# EAGLE design LDAQ-MOD-ENC4 (EAGLE 9.6.2)
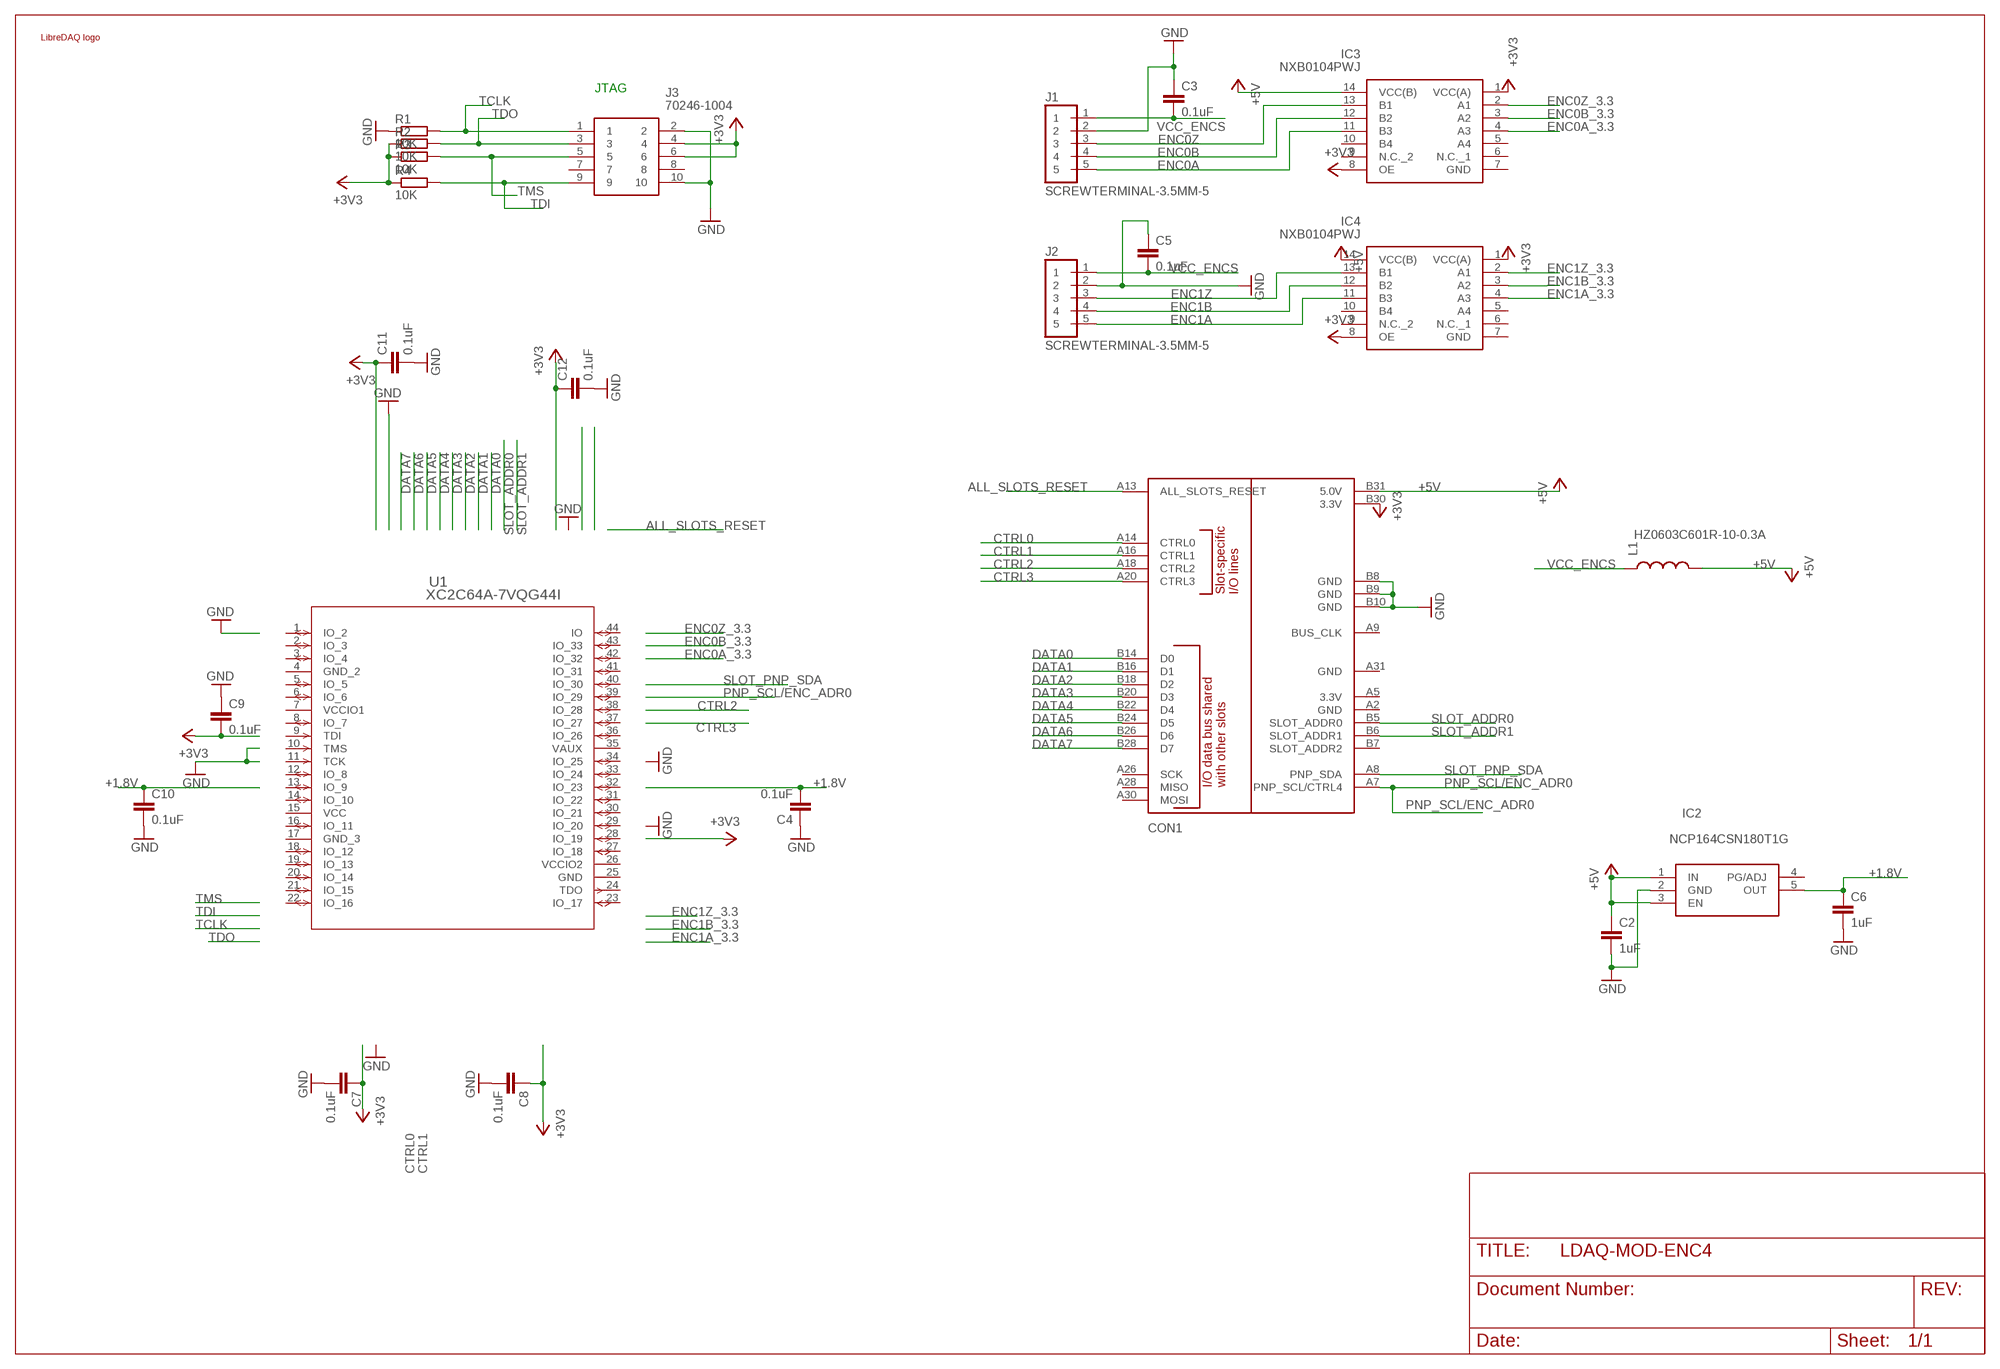
[diagram p0: schematic, sheet 1]

## Parts
C2  1uF  C-EUC0603  [C0603]
C3  0.1uF  0.1UF-25V(+80/-20%)(0603)  [0603-CAP]
C4  0.1uF  0.1UF-25V(+80/-20%)(0603)  [0603-CAP]
C5  0.1uF  0.1UF-25V(+80/-20%)(0603)  [0603-CAP]
C6  1uF  C-EUC0603  [C0603]
C7  0.1uF  0.1UF-25V(+80/-20%)(0603)  [0603-CAP]
C8  0.1uF  0.1UF-25V(+80/-20%)(0603)  [0603-CAP]
C9  0.1uF  0.1UF-25V(+80/-20%)(0603)  [0603-CAP]
C10  0.1uF  0.1UF-25V(+80/-20%)(0603)  [0603-CAP]
C11  0.1uF  0.1UF-25V(+80/-20%)(0603)  [0603-CAP]
C12  0.1uF  0.1UF-25V(+80/-20%)(0603)  [0603-CAP]
CON1  BOARD  LIBREDAQ_DAUGHTER_BOARDPCI-64-SIZE1-PADS  [PCI-E_64_EDGE_70X60_PADS-ONLY]
IC2  NCP164CSN180T1G  [SOT95P275X110-5N]
IC3  NXB0104PWJ  [SOP65P640X110-14N]
IC4  NXB0104PWJ  [SOP65P640X110-14N]
J1  SCREWTERMINAL-3.5MM-5  [SCREWTERMINAL-3.5MM-5]
J2  SCREWTERMINAL-3.5MM-5  [SCREWTERMINAL-3.5MM-5]
J3  70246-1004  [SHDR10W64P254_2X5_2032X889X927]
L1  HZ0603C601R-10-0.3A  INDUCTOR0603  [0603]
LOGO1  LIBREDAQ_LOGO_MINILOGO_GENERIC  [LIBREDAQ_LOGO]
R1  10K  R-EU_R0603  [R0603]
R2  10K  R-EU_R0603  [R0603]
R3  10K  R-EU_R0603  [R0603]
R4  10K  R-EU_R0603  [R0603]
U1  XC2C64A-7VQG44I  [44-VQFP_XIL]

## Nets
+1.8V: C4.2 C6.1 C10.1 IC2.5(OUT)
+3V3: C7.1 C8.1 C9.2 C11.1 C12.1 CON1.B30(3.3V) IC3.1(VCC(A)) IC3.8(OE) IC4.1(VCC(A)) IC4.8(OE) J3.4 J3.6 R2.1 R3.1 R4.1
+5V: C2.1 CON1.B31(5.0V) IC2.1(IN) IC2.3(EN) IC3.14(VCC(B)) IC4.14(VCC(B)) L1.2
ALL_SLOTS_RESET: CON1.A13(ALL_SLOTS_RESET)
CTRL0: CON1.A14(CTRL0)
CTRL1: CON1.A16(CTRL1)
CTRL2: CON1.A18(CTRL2)
CTRL3: CON1.A20(CTRL3)
DATA0: CON1.B14(D0)
DATA1: CON1.B16(D1)
DATA2: CON1.B18(D2)
DATA3: CON1.B20(D3)
DATA4: CON1.B22(D4)
DATA5: CON1.B24(D5)
DATA6: CON1.B26(D6)
DATA7: CON1.B28(D7)
ENC0A: IC3.11(B3) J1.5
ENC0A_3.3: IC3.4(A3)
ENC0B: IC3.12(B2) J1.4
ENC0B_3.3: IC3.3(A2)
ENC0Z: IC3.13(B1) J1.3
ENC0Z_3.3: IC3.2(A1)
ENC1A: IC4.11(B3) J2.5
ENC1A_3.3: IC4.4(A3)
ENC1B: IC4.12(B2) J2.4
ENC1B_3.3: IC4.3(A2)
ENC1Z: IC4.13(B1) J2.3
ENC1Z_3.3: IC4.2(A1)
GND: C2.2 C3.1 C4.1 C5.1 C6.2 C7.2 C8.2 C9.1 C10.2 C11.2 C12.2 CON1.B8(GND) CON1.B9(GND) CON1.B10(GND) IC2.2(GND) J1.2 J2.2 J3.2 J3.10 R1.1
PNP_SCL/ENC_ADR0: CON1.A7(PNP_SCL/CTRL4)
SLOT_ADDR0: CON1.B5(SLOT_ADDR0)
SLOT_ADDR1: CON1.B6(SLOT_ADDR1)
SLOT_PNP_SDA: CON1.A8(PNP_SDA)
TCLK: J3.1 R1.2
TDI: J3.9 R4.2
TDO: J3.3 R2.2
TMS: J3.5 R3.2
VCC_ENCS: C3.2 C5.2 J1.1 J2.1 L1.1
Unconnected: CON1.A2(GND) CON1.A5(3.3V) CON1.A9(BUS_CLK) CON1.A26(SCK) CON1.A28(MISO) CON1.A30(MOSI) CON1.A31(GND) CON1.B7(SLOT_ADDR2) IC2.4(PG/ADJ) IC3.5(A4) IC3.6(N.C._1) IC3.7(GND) IC3.9(N.C._2) IC3.10(B4) IC4.5(A4) IC4.6(N.C._1) IC4.7(GND) IC4.9(N.C._2) IC4.10(B4) J3.7 J3.8 U1.1(IO_2) U1.2(IO_3) U1.3(IO_4) U1.5(IO_5) U1.6(IO_6) U1.8(IO_7) U1.9(TDI) U1.10(TMS) U1.11(TCK) U1.12(IO_8) U1.13(IO_9) U1.14(IO_10) U1.16(IO_11) U1.18(IO_12) U1.19(IO_13) U1.20(IO_14) U1.21(IO_15) U1.22(IO_16) U1.23(IO_17) U1.24(TDO) U1.27(IO_18) U1.28(IO_19) U1.29(IO_20) U1.30(IO_21) U1.31(IO_22) U1.32(IO_23) U1.33(IO_24) U1.34(IO_25) U1.36(IO_26) U1.37(IO_27) U1.38(IO_28) U1.39(IO_29) U1.40(IO_30) U1.41(IO_31) U1.42(IO_32) U1.43(IO_33) U1.44(IO)

## Notes on the sheet
- JTAG

## Power pins joined to a net without a drawn wire
GND: U1.25(GND)
GND_2: U1.4(GND_2)
GND_3: U1.17(GND_3)
VAUX: U1.35(VAUX)
VCC: U1.15(VCC)
VCCIO1: U1.7(VCCIO1)
VCCIO2: U1.26(VCCIO2)

## Library data of the parts
C2 C6 = rcl:C-EU: CAPACITOR, European symbol; SPICEPREFIX: C
C3-C5 C7-C12 = SparkFun-Capacitors:0.1UF-25V(+80/-20%)(0603): CAP-00810 Ceramic Standard decoupling cap; PROD_ID: CAP-00810
CON1 = libredaq-comps:LIBREDAQ_DAUGHTER_BOARD: LibreDAQ Expansion board (PCI-E form)
IC2 = NCP164CSN180T1G:NCP164CSN180T1G: LDO Voltage Regulators LDO 300mA AD 1.8V Source: Datasheet <https://componentsearchengine.com/Datasheets/2/NCP164CSN180T1G.pdf>; DESCRIPTION: LDO Voltage Regulators LDO 300mA AD 1.8V; HEIGHT: 1.1mm; MANUFACTURER_NAME: ON Semiconductor; MANUFACTURER_PART_NUMBER: NCP164CSN180T1G; MOUSER_PART_NUMBER: 863-NCP164CSN180T1G; MOUSER_PRICE-STOCK: https://www.mouser.co.uk/ProductDetail/ON-Semiconductor/NCP164CSN180T1G?qs=xZ%2FP%252Ba9zWqawV010c68oIA%3D%3D
IC3 IC4 = NXB0104PWJ:NXB0104PWJ: Translation - Voltage Levels 3 STATE DUAL SUPPLY TRANS Source: Datasheet <https://componentsearchengine.com/Datasheets/2/NXB0104PWJ.pdf>; DESCRIPTION: Translation - Voltage Levels 3 STATE DUAL SUPPLY TRANS; HEIGHT: 1.1mm; MANUFACTURER_NAME: Nexperia; MANUFACTURER_PART_NUMBER: NXB0104PWJ; MOUSER_PART_NUMBER: 771-NXB0104PWJ; MOUSER_PRICE-STOCK: https://www.mouser.co.uk/ProductDetail/Nexperia/NXB0104PWJ/?qs=Cb2nCFKsA8qTpu5ekoCq9g%3D%3D
J1 J2 = libredaq-comps:SCREWTERMINAL-3.5MM-5
J3 = 70246-1004:70246-1004: Header 2.54mm, dual row, vertical, 10w Molex C-GRID Series, Series Number 70246, 2.54mm Pitch 10 Way 2 Row Shrouded Straight PCB Header, Through Hole Source: Datasheet <http://www.molex.com/pdm_docs/sd/702461004_sd.pdf>; DESCRIPTION: Header 2.54mm, dual row, vertical, 10w Molex C-GRID Series, Series Number 70246, 2.54mm Pitch 10 Way 2 Row Shrouded Straight PCB Header, Through Hole; HEIGHT: 9.27mm; MANUFACTURER_NAME: Molex; MANUFACTURER_PART_NUMBER: 70246-1004; MOUSER_PART_NUMBER: 538-70246-1004; MOUSER_PRICE-STOCK: https://www.mouser.co.uk/ProductDetail/Molex/70246-1004?qs=R7%2FZKp6KZ2by8%252BhtUWbo%252BQ%3D%3D
L1 = SparkFun-Passives:INDUCTOR: Inductors Basic Inductor/Choke - 0603 and 1206. Footprints are not proven and vary greatly between part numbers. SRN6045- 33uH, 20% 1.4A SDR0403-560KL - 56uH, 10%, 500mA RMS/740mA peak
LOGO1 = libredaq-comps:LIBREDAQ_LOGO_MINI
R1-R4 = rcl:R-EU_: RESISTOR, European symbol; SPICEPREFIX: R
U1 = XC2C64A-7VQG44I:XC2C64A-7VQG44I; COPYRIGHT: Copyright (C) 2021 Ultra Librarian. All rights reserved.; DIGI-KEY_PART_NUMBER_1: 122-1708-ND; DIGI-KEY_PART_NUMBER_2: XLCC-1042-ND; DIGI-KEY_PART_NUMBER_3: XLCC-1061-ND; DIGI-KEY_PART_NUMBER_4: XLCC-1062-ND; DIGI-KEY_PART_NUMBER_5: XLCC-1065-ND; DIGI-KEY_PART_NUMBER_6: XLCC-1066-ND; MANUFACTURER_PART_NUMBER: XC2C64A-7VQG44I; MFR_NAME: Xilinx Inc

## Board
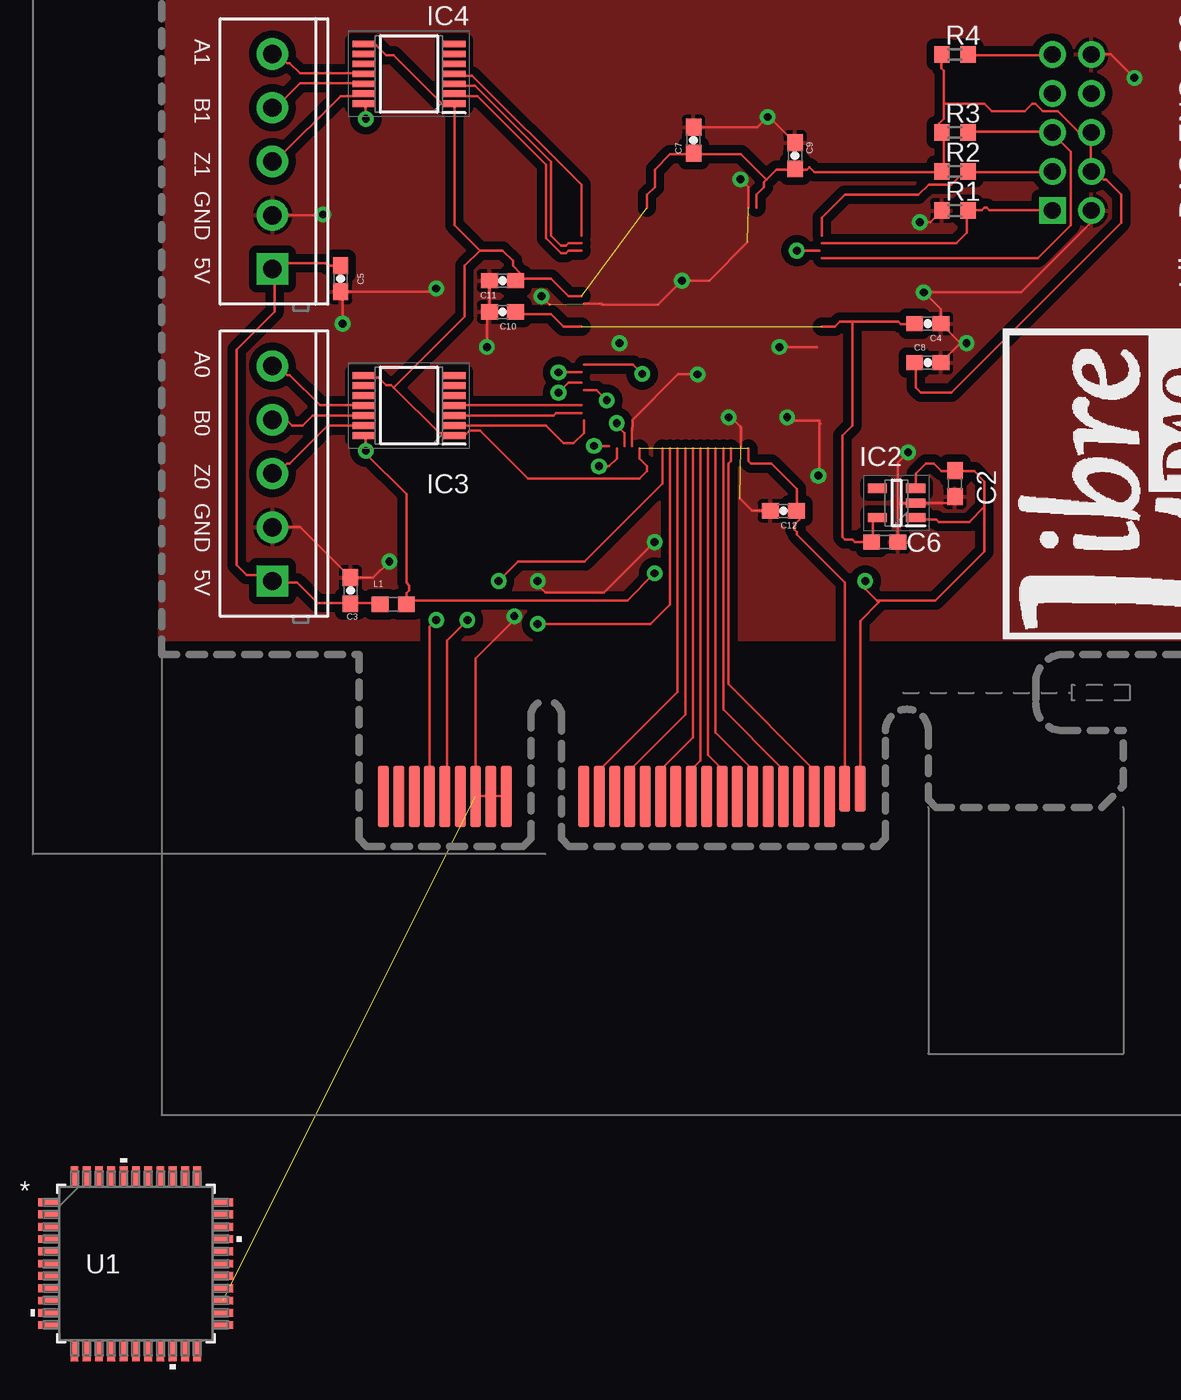
[diagram p1: board, top side]
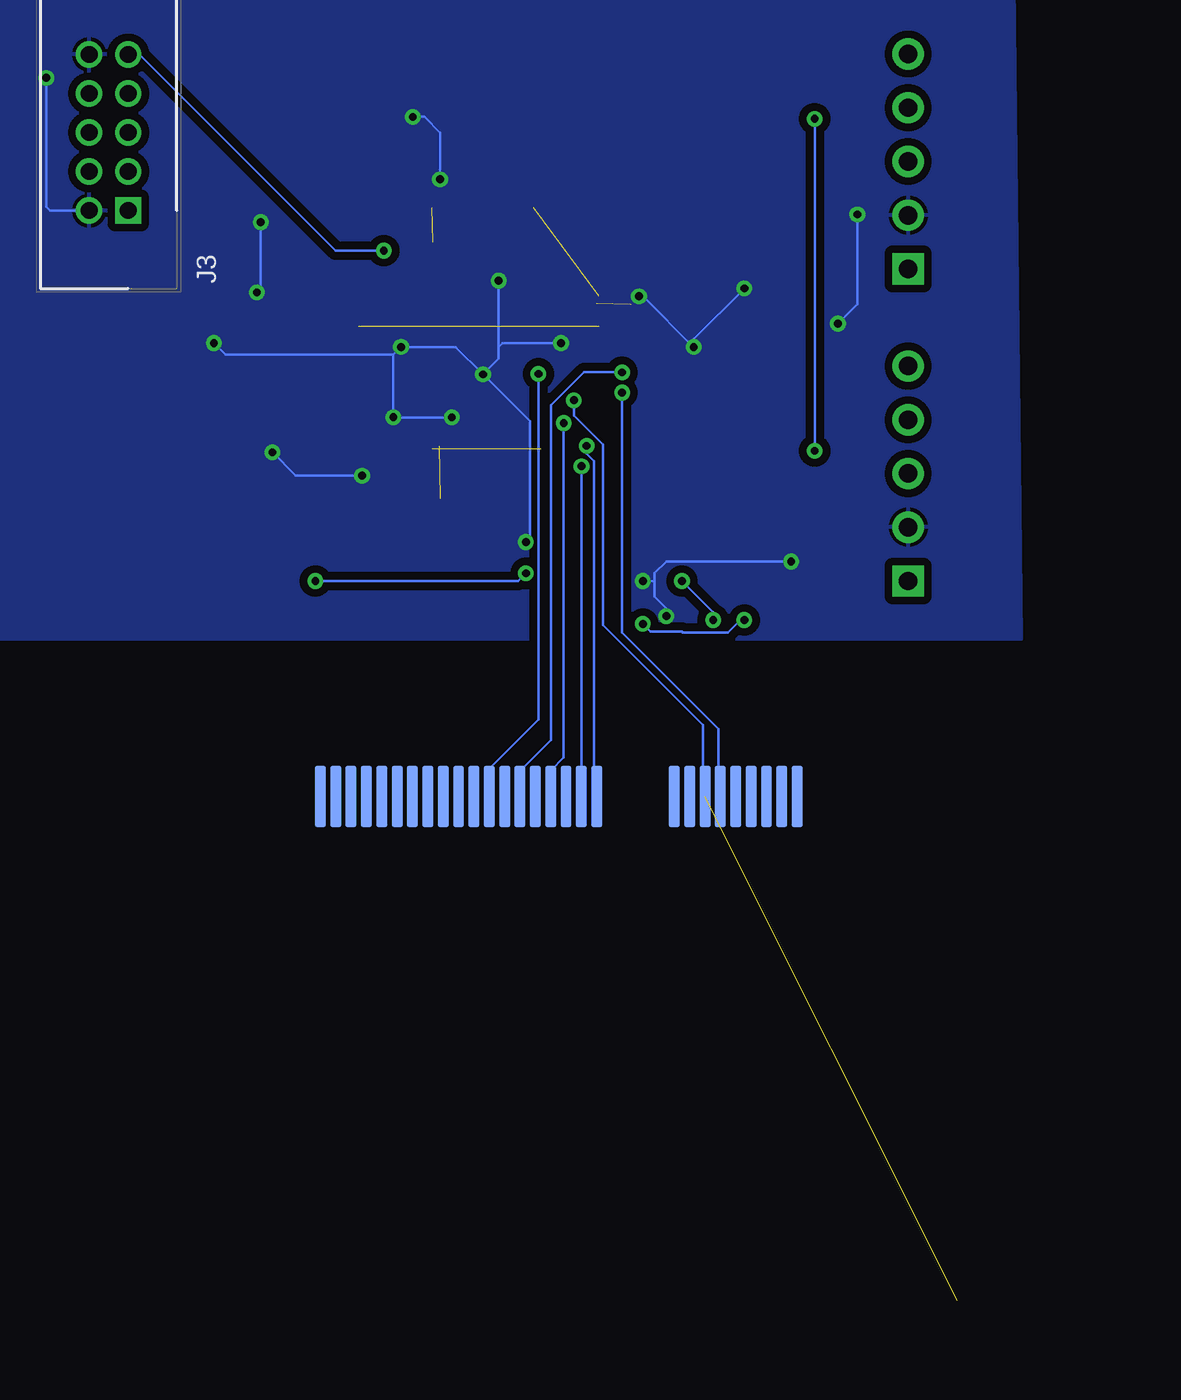
[diagram p2: board, bottom side, seen from below]

No outline drawn. Coordinates in mm, seen from the top.
Copper layers (1*16): Top 0.035mm / dielectric 1.5mm / Bottom 0.035mm
Design rules "LibreDAQ *": minimum track width 7mil, minimum drill 20mil, track to track 6mil, track to pad 7mil, pad to pad 7mil, via to via 8mil, smd to smd 7mil, copper to edge 6mil, drill to drill 8mil, minimum pad ring 12mil, minimum via ring 10mil, stop-mask expansion 4mil, vias tented up to drill 25mil, thermal gap 10mil
tKeepout: 58 lines
bKeepout: 30 lines

### Footprints (pad centres in the part's own frame; a part is rotated, then mirrored left to right if it is on the bottom)
C0603 = smd 1.1 x 1: 1 -0.85,0; 2 0.85,0
0603-CAP = smd 1.1 x 1: 1 -0.85,0; 2 0.85,0
PCI-E_64_EDGE_70X60_PADS-ONLY = smd 0.7 x 4 bottom: A2 -10.55,3.75; A3 -9.55,3.75; A4 -8.55,3.75; A5 -7.55,3.75; A6 -6.55,3.75; A7 -5.55,3.75; A8 -4.55,3.75; A9 -3.55,3.75; A10 -2.55,3.75; A13 2.5,3.75; A14 3.5,3.75; A15 4.5,3.75; A16 5.5,3.75; A17 6.5,3.75; A18 7.5,3.75; A19 8.5,3.75; A20 9.5,3.75; A21 10.5,3.75; A22 11.5,3.75; A23 12.5,3.75; A24 13.5,3.75; A25 14.5,3.75; A26 15.5,3.75; A27 16.5,3.75; A28 17.5,3.75; A29 18.5,3.75; A30 19.5,3.75; A31 20.5,3.75 | smd 0.7 x 4: B2 -10.55,3.75; B3 -9.55,3.75; B4 -8.55,3.75; B5 -7.55,3.75; B6 -6.55,3.75; B7 -5.55,3.75; B8 -4.55,3.75; B9 -3.55,3.75; B10 -2.55,3.75; B13 2.5,3.75; B14 3.5,3.75; B15 4.5,3.75; B16 5.5,3.75; B17 6.5,3.75; B18 7.5,3.75; B19 8.5,3.75; B20 9.5,3.75; B21 10.5,3.75; B22 11.5,3.75; B23 12.5,3.75; B24 13.5,3.75; B25 14.5,3.75; B26 15.5,3.75; B27 16.5,3.75; B28 17.5,3.75; B29 18.5,3.75 | smd 0.7 x 3: B30 19.5,4.25; B31 20.5,4.25
SOT95P275X110-5N = smd 1.25 x 0.6: 1 -1.25,0.95; 2 -1.25,0; 3 -1.25,-0.95; 4 1.25,-0.95; 5 1.25,0.95
SOP65P640X110-14N = smd 1.475 x 0.45: 1 -2.938,1.95; 2 -2.938,1.3; 3 -2.938,0.65; 4 -2.938,0; 5 -2.938,-0.65; 6 -2.938,-1.3; 7 -2.938,-1.95; 8 2.938,-1.95; 9 2.938,-1.3; 10 2.938,-0.65; 11 2.938,0; 12 2.938,0.65; 13 2.938,1.3; 14 2.938,1.95
SCREWTERMINAL-3.5MM-5 = drill 1.2 pad 2.032 square: 1 0,0 | drill 1.2 pad 2.032: 2 3.5,0; 3 7,0; 4 10.5,0; 5 14,0
SHDR10W64P254_2X5_2032X889X927 = drill 1.1 pad 1.65 square: 1 0,0 | drill 1.1 pad 1.65: 2 0,2.54; 3 2.54,0; 4 2.54,2.54; 5 5.08,0; 6 5.08,2.54; 7 7.62,0; 8 7.62,2.54; 9 10.16,0; 10 10.16,2.54
0603 = smd 1.1 x 1: 1 -0.85,0; 2 0.85,0
R0603 = smd 1 x 1.1: 1 -0.85,0; 2 0.85,0
44-VQFP_XIL = smd 1.346 x 0.508: 1 -5.677,4; 2 -5.677,3.2; 3 -5.677,2.4; 4 -5.677,1.6; 5 -5.677,0.8; 6 -5.677,0; 7 -5.677,-0.8; 8 -5.677,-1.6; 9 -5.677,-2.4; 10 -5.677,-3.2; 11 -5.677,-4; 23 5.677,-4; 24 5.677,-3.2; 25 5.677,-2.4; 26 5.677,-1.6; 27 5.677,-0.8; 28 5.677,0; 29 5.677,0.8; 30 5.677,1.6; 31 5.677,2.4; 32 5.677,3.2; 33 5.677,4 | smd 0.508 x 1.346: 12 -4,-5.677; 13 -3.2,-5.677; 14 -2.4,-5.677; 15 -1.6,-5.677; 16 -0.8,-5.677; 17 0,-5.677; 18 0.8,-5.677; 19 1.6,-5.677; 20 2.4,-5.677; 21 3.2,-5.677; 22 4,-5.677; 34 4,5.677; 35 3.2,5.677; 36 2.4,5.677; 37 1.6,5.677; 38 0.8,5.677; 39 0,5.677; 40 -0.8,5.677; 41 -1.6,5.677; 42 -2.4,5.677; 43 -3.2,5.677; 44 -4,5.677

### Placement (x,y rotation side)
C2  52.07,24.13 270 top
C3  12.7,17.14 270 top
C4  50.29,34.54 180 top
C5  12.06,37.47 90 top
C6  47.5,20.32 0 top
C7  35.05,46.48 90 top
C8  50.29,32 0 top
C9  41.66,45.47 270 top
C10  22.61,35.31 180 top
C11  22.61,37.34 180 top
C12  40.89,22.35 180 top
CON1  25.4,0 0 top
IC2  48.26,22.86 180 top
IC3  16.51,29.21 180 top
IC4  16.51,50.8 180 top
J1  7.62,17.78 90 top
J2  7.62,38.1 90 top
J3  58.42,41.91 90 bottom
L1  15.49,16.26 0 top
LOGO1  70.1,13.97 90 top
R1  52.07,41.91 0 top
R2  52.07,44.45 0 top
R3  52.07,46.99 0 top
R4  52.07,52.07 0 top
U1  -1.27,-26.67 0 top

### Tracks (layer width: path | path; a pad name or v marks a point on that pad's centre or on a via)
+1.8V  (1 unrouted)
  Top 0.178: 27.74,34.34 26.58,34.34 25.76,35.17 23.61,35.17 C10.1 | IC2.5 46.89,21.79 46.72,21.63 46.72,20.47 C6.1 46.56,20.31 45.57,20.31 45.4,20.47 44.91,20.47 44.74,20.64 44.74,27.24 45.4,27.9 45.4,34.67 | 45.4,34.67 44.58,34.67 44.25,34.34 43.42,34.34 | 45.4,34.67 48.37,34.67 48.54,34.51 49.37,34.51 C4.2
+3V3  (2 unrouted)
  Top 0.178: 38.63,26.42 38.63,25.59 38.8,25.43 40.12,25.43 41.77,23.77 41.77,22.45 C12.1 41.77,22.29 41.94,22.12 41.94,21.79 41.6,21.46 41.6,21.13 41.77,20.97 41.77,20.8 44.91,17.67 44.91,4.29 CON1.B30 | C8.1 49.53,31.86 49.53,30.38 49.86,30.05 51.84,30.05 62.9,41.11 62.9,42.93 61.91,43.92 61.75,43.92 61.09,44.58 J3.4 60.92,44.58 60.92,46.89 J3.6 60.92,47.05 60.1,47.05 58.78,48.37 57.78,48.37 57.29,48.87 57.12,48.87 56.63,48.37 54.48,48.37 53.99,48.87 51.35,48.87 | IC4.8 13.7,52.67 14.36,52.67 15.02,52.01 15.52,52.01 18.66,48.87 19.32,48.87 IC4.1 19.48,48.7 19.48,40.95 21.13,39.29 | 15.52,30.38 15.35,30.54 15.02,30.54 14.53,31.04 13.7,31.04 IC3.8 | 15.52,30.38 18.49,27.41 19.32,27.41 IC3.1 19.48,27.24 20.14,27.24 20.47,27.57 21.13,27.57 24.27,24.43 31.53,24.43 32.03,24.93 32.03,25.26 31.53,25.76 31.53,26.42 | 51.35,48.87 51.35,47.88 51.02,47.55 51.02,47.22 51.18,47.05 R3.1 51.35,46.89 51.35,44.58 R2.1 51.18,44.41 42.93,44.41 42.6,44.74 42.43,44.58 41.77,44.58 C9.2 41.6,44.58 40.45,44.58 39.79,43.92 | 51.35,48.87 51.35,51.02 51.18,51.18 51.18,52.01 R4.1 | 23.77,37.48 25.76,37.48 26.91,36.32 27.74,36.32 | 23.77,37.48 23.61,37.48 C11.1 23.77,37.48 | 39.79,43.92 39.62,43.75 39.62,43.42 39.13,42.93 39.13,42.1 | 32.03,42.1 32.03,42.93 32.52,43.42 32.52,44.58 33.52,45.57 35,45.57 C7.1 35.17,45.57 38.14,45.57 39.79,43.92 | 15.52,30.38 20.14,35 20.14,38.3 21.13,39.29 | 21.13,39.29 22.62,39.29 23.28,38.63 23.28,38.3 23.77,37.81 23.77,37.48
+5V  (via drill 0.51)
  Top 0.178: IC2.3 49.53,23.94 49.53,24.77 50.19,25.43 50.69,25.43 51.18,24.93 52.01,24.93 C2.1 52.17,24.93 53.33,24.93 53.99,24.27 53.99,22.62 | 53.99,22.62 53,21.63 51.02,21.63 50.85,21.79 49.53,21.79 IC2.1 | IC3.14 13.7,27.24 v13.7,26.25 13.7,26.09 16.34,23.44 16.34,17.67 16.51,17.5 16.51,17.17 16.34,17 16.34,16.34 L1.2 16.34,16.18 16.68,16.51 30.73,16.51 v32.51,18.29 | v13.7,47.88 13.7,48.7 IC4.14 | 45.9,4.13 CON1.B31 45.9,4.29 45.9,15.19 47.1,16.4 46.99,16.51 | 46.99,16.51 46.23,17.27 v46.23,17.78 | 46.99,16.51 50.8,16.51 53.99,19.7 53.99,22.62
  Bottom 0.178: v13.7,26.25 v13.7,47.88 | v46.23,17.78 33.02,17.78 v32.51,18.29
ALL_SLOTS_RESET  (via drill 0.51)
  Top 0.178: v28.56,26.58 29.55,26.58
  Bottom 0.178: v28.56,26.58 28.56,26.09 28.07,25.59 28.07,3.96 27.9,3.8 CON1.A13
CTRL0  (via drill 0.51)
  Top 0.178: 30.05,26.42 30.05,25.76 29.55,25.26 v28.89,25.26
  Bottom 0.178: v28.89,25.26 28.89,3.8 CON1.A14
CTRL1  (via drill 0.51)
  Top 0.178: 30.54,26.58 30.54,27.41 30.05,27.9 v30.05,28.07
  Bottom 0.178: v30.05,28.07 30.05,6.27 30.87,5.45 30.87,3.8 CON1.A16
CTRL2  (via drill 0.51)
  Top 0.178: v26.25,31.37 27.74,31.37
  Bottom 0.178: v26.25,31.37 28.73,31.37 30.87,29.22 30.87,7.43 32.85,5.45 32.85,3.8 CON1.A18
CTRL3  (via drill 0.51)
  Top 0.178: 27.9,31.86 31.1,31.86 v31.7,31.27
  Bottom 0.178: v31.7,31.27 31.7,8.75 34.84,5.61 34.84,3.8 CON1.A20
DATA0
  Top 0.178: 34.01,26.42 34.01,10.57 29.06,5.61 29.06,3.8 CON1.B14
DATA1
  Top 0.178: 34.51,26.42 34.51,9.08 31.04,5.61 31.04,3.8 CON1.B16
DATA2
  Top 0.178: 35,26.42 35,7.59 33.02,5.61 33.02,3.8 CON1.B18
DATA3
  Top 0.178: 35.5,26.42 35.5,6.11 35,5.61 35,3.8 CON1.B20
DATA4
  Top 0.178: 35.99,26.42 35.99,6.44 36.82,5.61 36.82,3.8 CON1.B22
DATA5
  Top 0.178: 36.49,26.42 36.49,7.92 38.8,5.61 38.8,3.8 CON1.B24
DATA6
  Top 0.178: 36.98,26.42 36.98,9.41 40.78,5.61 40.78,3.8 CON1.B26
DATA7
  Top 0.178: 37.48,26.42 37.48,25.59 37.31,25.43 37.31,11.06 42.76,5.61 42.76,3.8 CON1.B28
ENC0A
  Top 0.178: IC3.11 13.54,29.22 10.73,29.22 8.75,31.2 8.59,31.2 8.09,31.7 7.76,31.7 J1.5
ENC0A_3.3
  Top 0.178: 27.74,29.22 19.48,29.22 IC3.4
ENC0B
  Top 0.178: IC3.12 13.54,28.56 10.24,28.56 9.58,27.9 8.91,27.9 8.59,28.23 7.76,28.23 J1.4
ENC0B_3.3
  Top 0.178: 27.74,28.73 26.09,28.73 25.92,28.56 19.48,28.56 IC3.3
ENC0Z
  Top 0.178: IC3.13 13.54,27.9 11.23,27.9 8.75,25.43 8.59,25.43 8.09,24.93 7.76,24.93 J1.3
ENC0Z_3.3
  Top 0.178: 27.9,28.23 27.9,27.41 27.24,26.75 26.58,26.75 25.43,27.9 19.48,27.9 IC3.2
ENC1A
  Top 0.178: IC4.11 13.54,50.85 9.41,50.85 8.75,51.51 8.59,51.51 8.09,52.01 7.76,52.01 J2.5
ENC1A_3.3
  Top 0.178: 27.74,40.28 27.74,43.59 20.64,50.69 19.48,50.69 IC4.4
ENC1B
  Top 0.178: IC4.12 13.54,50.19 9.41,50.19 7.76,48.54 J2.4
ENC1B_3.3
  Top 0.178: 27.74,39.79 26.91,39.79 26.75,39.62 26.42,39.62 25.76,40.28 25.76,45.07 20.8,50.02 19.48,50.02 IC4.3
ENC1Z
  Top 0.178: IC4.13 13.54,49.37 12.05,49.37 7.76,45.07 J2.3
ENC1Z_3.3
  Top 0.178: 27.74,39.29 26.91,39.29 26.75,39.13 26.42,39.13 25.43,40.12 25.43,44.91 20.97,49.37 19.48,49.37 IC4.2
GND  (via drill 0.51)  (4 unrouted)
  Top 0.178: CON1.B10 22.78,3.8 21.96,3.8 CON1.B9 21.79,3.8 20.97,3.8 CON1.B8 20.85,12.72 23.37,15.24 v23.37,15.49 | 31.04,26.58 31.04,27.74 31.07,27.81 31.07,28.27 34.04,31.24 v35.31,31.24 | 38.14,26.58 38.14,27.74 38.1,27.82 37.49,28.43 v37.34,28.43 | 27.9,35.83 29.06,35.83 29.08,35.78 32.74,35.78 v34.29,37.34 36.07,37.34 38.56,39.83 | 43.26,28.07 43.26,28.23 41.36,28.23 v41.15,28.45 | 43.26,28.07 43.3,28.03 | 38.63,42.1 38.63,43.26 38.61,43.3 38.61,43.43 v38.1,43.94 | v15.24,19.05 14.19,18 C3.1 9.41,21.28 J1.2 | 38.06,23.15 38.86,22.35 C12.2 | 43.07,33.02 v40.64,33.02 | C8.2 52.41,33.27 | C9.1 39.97,48.01 v39.88,48.01 39.2,47.33 C7.2 | J3.10 62.23,52.07 v63.75,50.55 | R1.1 50.46,41.15 v49.78,41.15 | 52.41,33.27 C4.1 51.14,35.47 v50.04,36.58 56.39,36.58 60.96,41.15 J3.2 | 52.41,33.27 v52.83,33.27 | v18.29,36.83 18.07,36.62 C5.1 12.19,36.49 v12.19,34.54 | v21.59,33.02 21.59,35.14 C10.2 C11.2 | J2.2 10.87,41.6 v10.92,41.66 | v32.51,20.32 29.21,17.02 25.4,17.02 24.89,17.53 v24.89,17.78 | 30.21,33.29 v30.23,33.27 | 25.68,35.79 v25.15,36.32 | C2.2 51.65,22.86 IC2.2 48.51,22.86 48.35,22.69 | C6.2 48.35,22.69 | 43.26,28.07 43.26,24.71 v43.18,24.64 | v49.02,26.16 48.35,25.49 48.35,22.69
  Bottom 0.178: 41.15,32.51 v40.64,33.02 37.08,33.02 v35.31,31.24 | 41.15,32.51 v41.15,28.45 41.13,28.43 v37.34,28.43 | v52.83,33.27 52.07,32.51 41.15,32.51 | v23.37,15.49 23.37,16 24.13,16.76 24.13,17.78 | 24.13,17.78 24.13,18.29 23.37,19.05 v15.24,19.05 | v38.1,43.94 38.1,46.99 39.12,48.01 v39.88,48.01 | v63.75,50.55 63.75,42.16 63.5,41.91 J3.2 | v49.78,41.15 49.78,36.83 v50.04,36.58 | v34.29,37.34 34.29,33.02 | 34.29,33.02 34.29,32.26 v35.31,31.24 | v18.29,36.83 21.59,33.53 v21.59,33.02 24.89,36.32 v25.15,36.32 | v10.92,41.66 10.92,35.81 v12.19,34.54 | v35.31,31.24 32.26,28.19 32.26,20.57 v32.51,20.32 | v24.89,17.78 24.13,17.78 | v30.23,33.27 34.04,33.27 34.29,33.02 | v43.18,24.64 47.5,24.64 v49.02,26.16
  pour Top (isolate 0.508): 0.76,59.69 0.25,13.97 70.1,13.97 69.85,59.69
  pour Bottom (isolate 0.508): 0.76,59.69 0.25,13.97 70.1,13.97 69.85,59.69
PNP_SCL/ENC_ADR0  (via drill 0.51)
  Top 0.178: 27.74,30.71 26.91,30.71 v26.25,30.05
  Bottom 0.178: v26.25,30.05 26.25,14.43 19.98,8.15 19.98,3.8 CON1.A7
SLOT_ADDR0  (via drill 0.51)
  Top 0.178: 33.52,26.42 33.52,16.24 32.26,14.99 v24.89,14.99 | 18,1.82 18,3.63 CON1.B5 17.85,14.8 v18.29,15.24
  Bottom 0.178: v18.29,15.24 18.54,15.24 19.34,14.44 22.31,14.44 22.35,14.48 24.38,14.48 v24.89,14.99
SLOT_ADDR1  (via drill 0.51)
  Top 0.178: CON1.B6 18.99,3.8 18.99,13.91 v20.32,15.24 | v22.35,17.78 23.62,19.05 27.94,19.05 33.02,24.13 33.02,26.42
  Bottom 0.178: v20.32,15.24 20.32,15.75 v22.35,17.78
SLOT_PNP_SDA  (via drill 0.51)
  Top 0.178: 27.9,30.21 28.73,30.21 v29.39,29.55
  Bottom 0.178: v29.39,29.55 29.39,28.56 27.48,26.66 27.48,14.92 20.97,8.41 20.97,3.8 CON1.A8
TCLK
  Top 0.178: J3.1 58.28,41.94 54.32,41.94 54.15,42.1 53.99,42.1 53.82,41.94 53,41.94 R1.2 52.83,41.77 52.83,40.45 52.17,39.79 43.42,39.79
TDI  (via drill 0.51)
  Top 0.178: R4.2 53,52.01 58.28,52.01 J3.9 | v41.77,39.29 43.26,39.29
  Bottom 0.178: v41.77,39.29 44.91,39.29 57.62,52.01 58.28,52.01 J3.9
TDO
  Top 0.178: J3.3 58.28,44.41 53,44.41 R2.2 52.83,44.58 51.84,43.59 50.35,43.59 49.7,42.93 44.91,42.93 43.42,41.44 43.42,40.28
TMS
  Top 0.178: R3.2 53,47.05 58.28,47.05 J3.5 58.45,46.89 59.6,45.73 59.6,40.95 57.45,38.8 43.42,38.8
VCC_ENCS
  Top 0.178: C5.2 12.05,38.3 11.23,38.3 11.06,38.47 8.09,38.47 7.76,38.14 J2.1 7.76,37.97 7.76,35.33 5.28,32.85 5.28,18.82 5.94,18.16 7.26,18.16 7.59,17.83 J1.1 7.76,17.67 9.25,17.67 10.57,16.34 12.55,16.34 C3.2 12.71,16.34 14.53,16.34 L1.1

### Text on the board
tPlace: LibreDAQ ENC v2.0
tNames: A1 | B1 | Z1 | GND | 5V | A0 | B0 | Z0 | GND | 5V